# EasyEDA Pro project ProProject_基于CW32单片机的无刷电机控制器（旋转变压器位置反馈）_2024-06-02.epro, schematic Schematic3
Create Date: 2024-05-23; Page Name: P1; Project Name: 基于CW32单片机的伺服电机控制器; Schematic Name: Schematic3; Update Date: 2024-05-23; Company: 嘉立创EDA; Page Size: A4; Version: V1.0
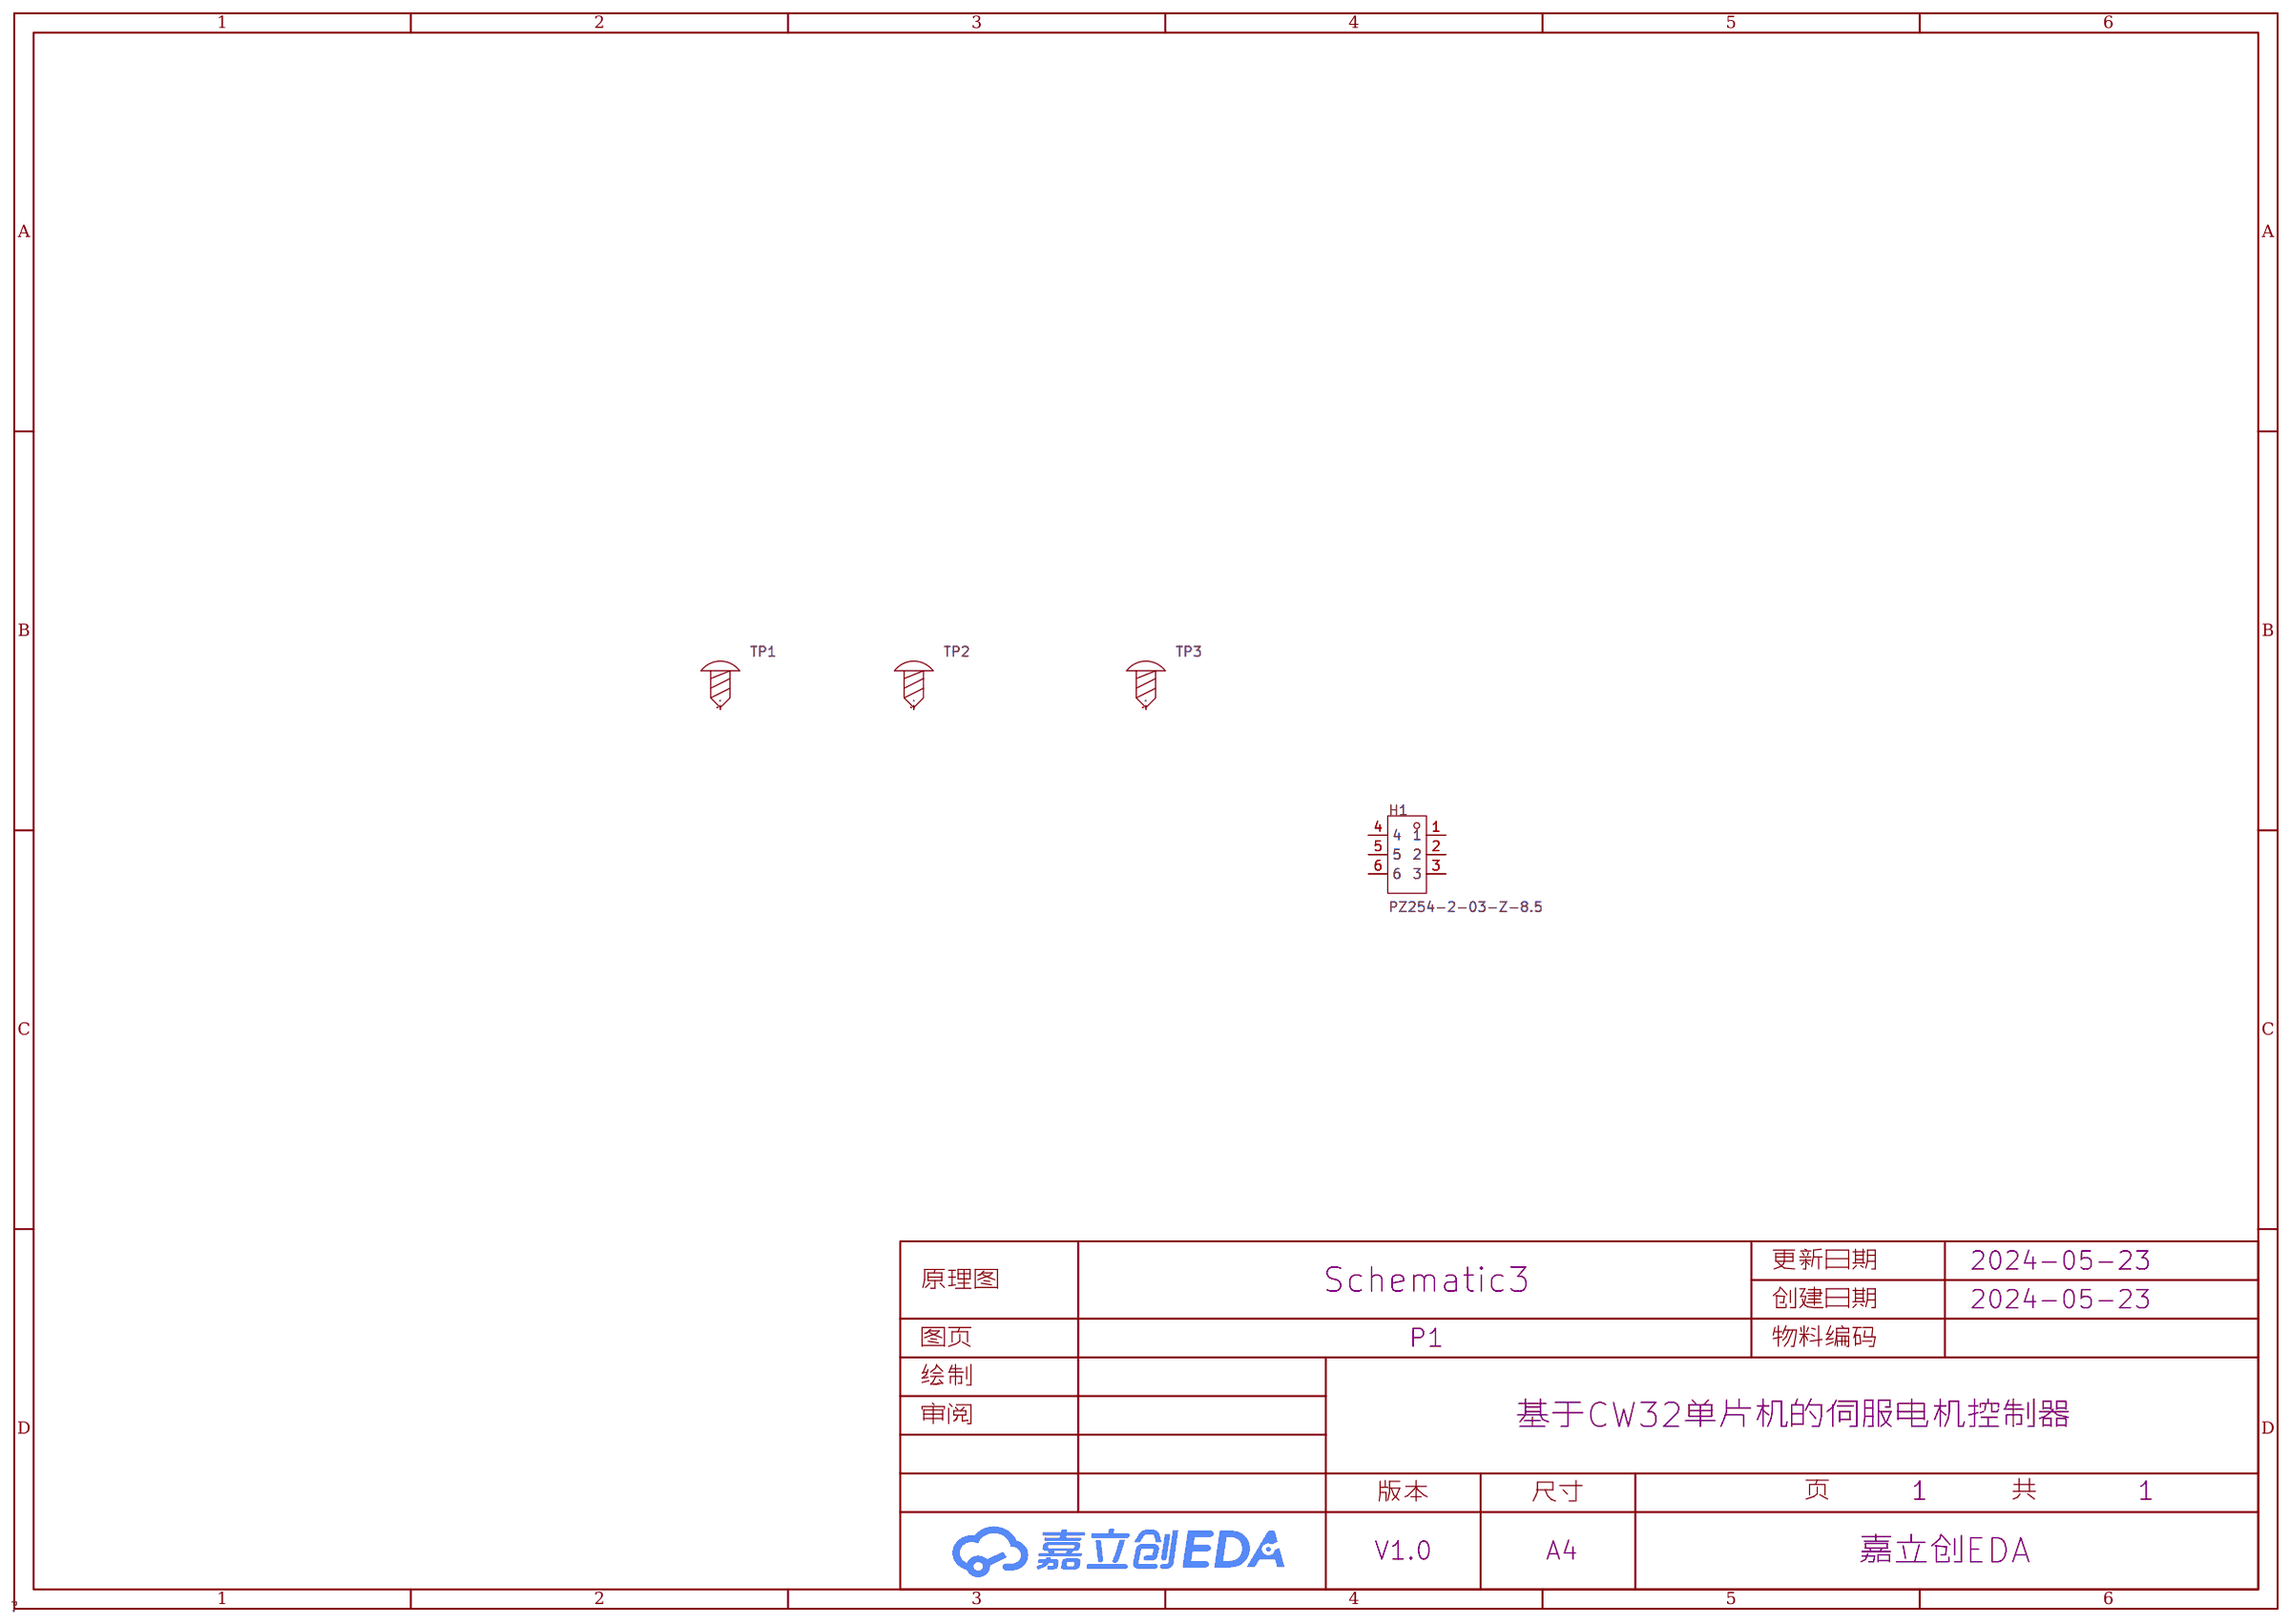
[diagram p2: schematic sheet]

## Parts
H1  PZ254-2-03-Z-8.5  [HDR-TH_6P-P2.54-V-M-R2-C3-S2.54]
TP1  -  [M2螺丝]
TP2  -  [M2螺丝]
TP3  -  [M2螺丝]

## Library data of the parts
H1 = PZ254-2-03-Z-8.5_C2894964: 排数:双排;总PIN位数:6;间距:2.54mm;插针结构:2x3P;行距:2.54mm;安装类型:直插;圆针/方针:方针;额定电流:3A;额定电压:-;配合针长度:6mm;塑高:2.5mm;端接针长度:3mm;触头材质:-;工作温度范围:-40℃~+105℃;颜色:黑色;; Supplier: LCSC; Supplier Part: C2894964; Manufacturer: HCTL(华灿天禄); JLCPCB Part Class: 扩展库; LCSC Part Name: 2.54mm 2x3P 直插 方针; Supplier Footprint: 直插,P=2.54mm; Number of Rows: 双排; Number of Pins: 6; Pitch: 2.54mm; Pin Structure: 2x3P; Row Spacing: 2.54mm; Mounting Type: 直插; Circluar Pins/Square Pins: 方针; Current Rating (Max): 3A; Length of Mating Pin: 6mm; Insulation Height: 2.5mm; Length of End Connection Pin: 3mm; Operating Temperature Range: -40℃~+105℃; Color: 黑色
TP1-TP3 = M2螺丝: Supplier Footprint: 插件

## Nets

Not connected (* = marked no-connect by the designer): H1 1 2 3 4 5 6; TP1 1; TP2 1; TP3 1
